# EAGLE design heated-build-platform (EAGLE 5.07)
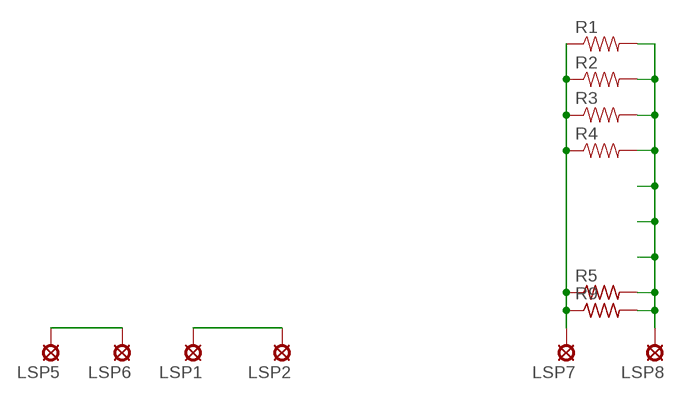
[diagram p0: schematic, sheet 1]

## Parts
LSP1  LSP10  [LSP10]
LSP2  LSP10  [LSP10]
LSP5  LSP10  [LSP10]
LSP6  LSP10  [LSP10]
LSP7  LSP10  [LSP10]
LSP8  LSP10  [LSP10]
R1  RESISTOR  [0805]
R2  RESISTOR  [0805]
R3  RESISTOR1206  [1206]
R4  RESISTOR1206  [1206]
R5  R-US_0204/5  [0204/5]
R9  R-US_0204/5  [0204/5]

## Nets
N$3: LSP1.MP LSP2.MP
N$4: LSP5.MP LSP6.MP
N$5: LSP8.MP R1.2 R2.2 R3.2 R4.2 R5.2 R9.2
N$6: LSP7.MP R1.1 R2.1 R3.1 R4.1 R5.1 R9.1

## Library data of the parts
LSP1 LSP2 LSP5-LSP8 = solpad:LSP10: SOLDER PAD drill 1.0 mm, distributor Buerklin, 12H555
R1-R4 = SparkFun:RESISTOR: Resistor Basic schematic elements and footprints for 0603, 1206, and PTH 1/10th watt (small) resistors.
R5 R9 = resistor:R-US_: RESISTOR, American symbol

## Board
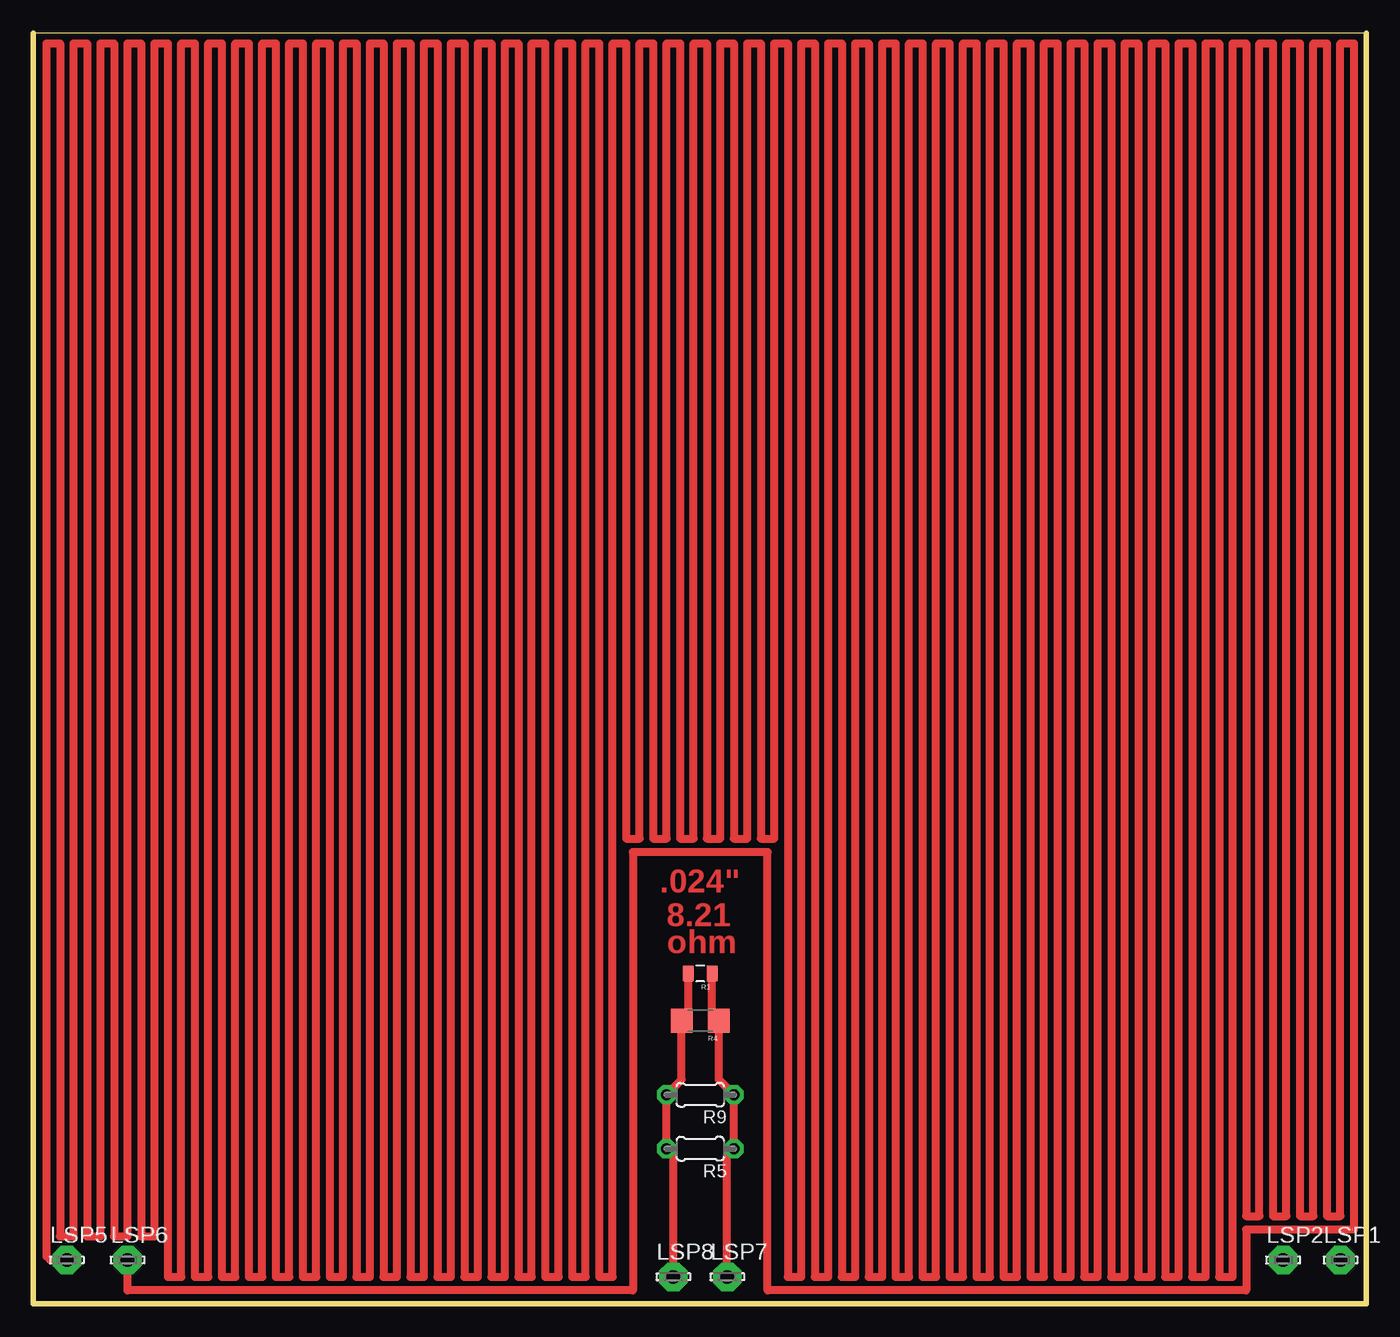
[diagram p1: board, top side]
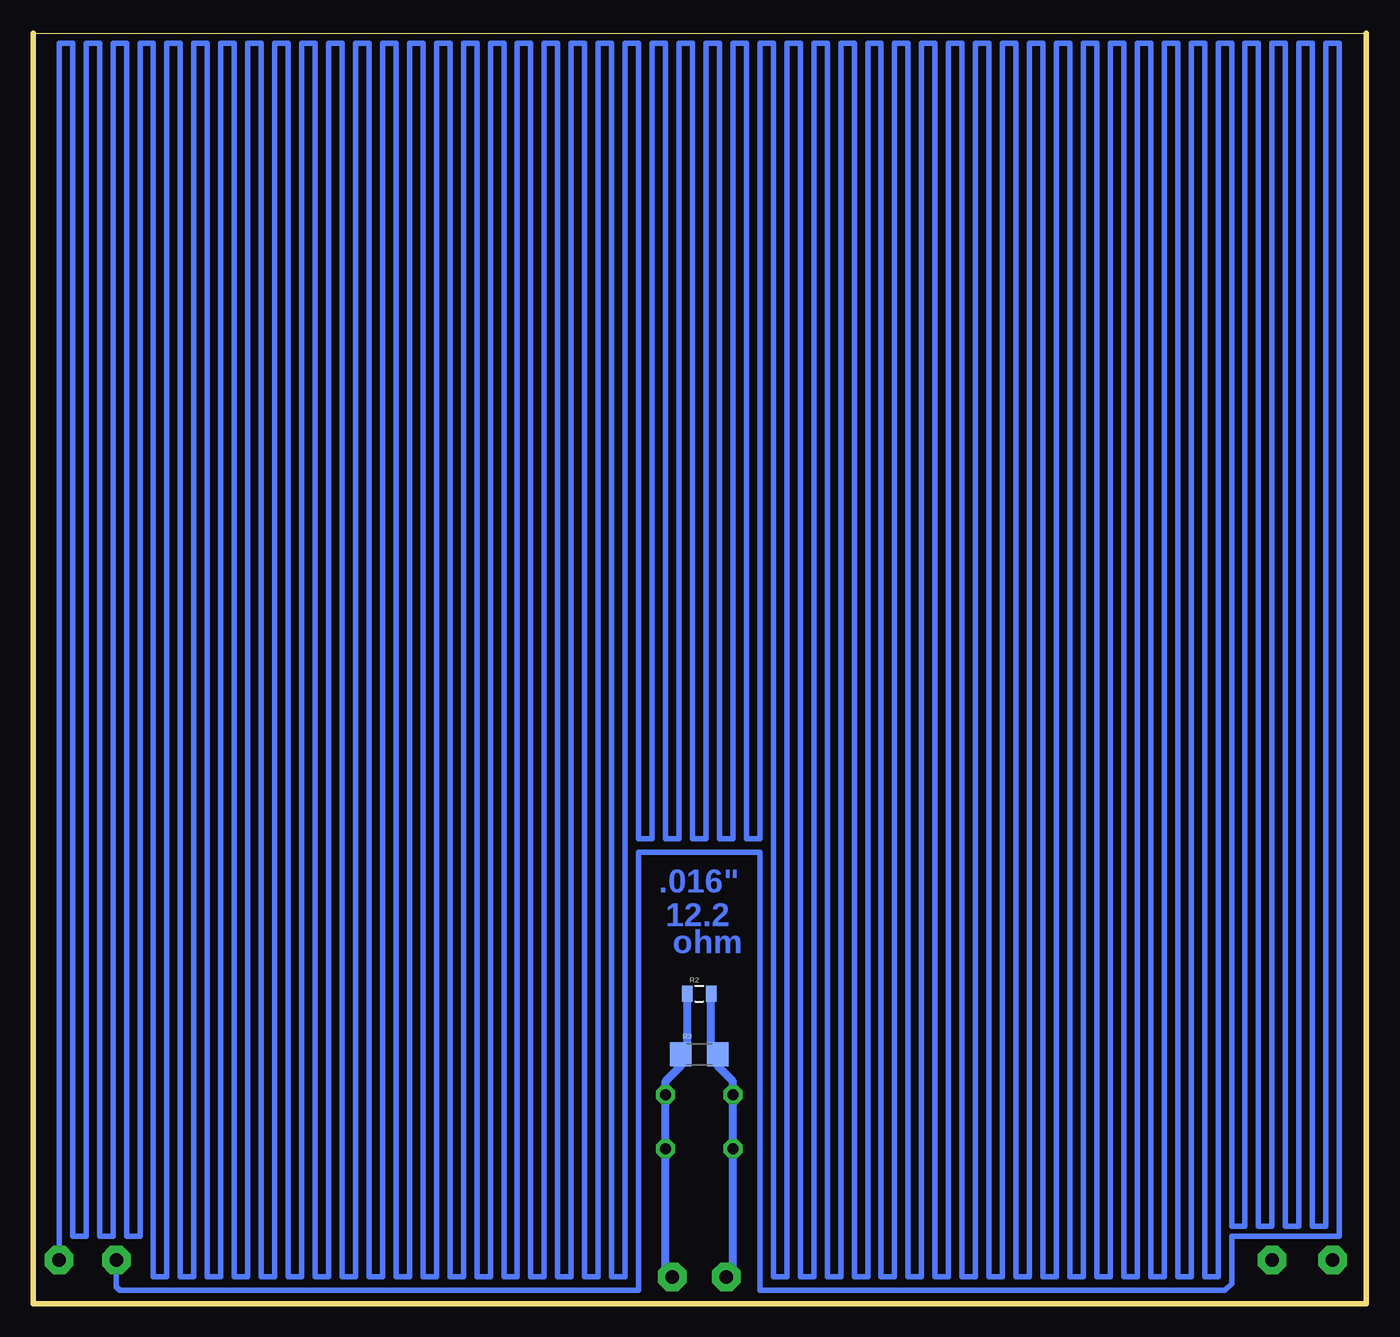
[diagram p2: board, bottom side, seen from below]

Size 100.51 x 95.76 mm. Coordinates in mm from the lower left corner, seen from the top.
Outline: 0,0 100.51,0 100.51,95.75 0,95.76 0,0
Copper layers (1*16): Top 0.035mm / dielectric 1.5mm / Bottom 0.035mm
Design rules "SparkFun": minimum track width 8mil, minimum drill 20mil, track to track 8mil, track to pad 8mil, pad to pad 8mil, via to via 8mil, smd to smd 8mil, copper to edge 10mil, drill to drill 8mil, minimum pad ring 12mil, minimum via ring 10mil, stop-mask expansion 4mil, vias tented up to drill 25mil, thermal gap 10mil

### Footprints (pad centres in the part's own frame; a part is rotated, then mirrored left to right if it is on the bottom)
LSP10 = drill 1.016 pad 2.159 octagon: MP 0,0
0805 = smd 0.8 x 1.2: 1 -0.9,0; 2 0.9,0
1206 = smd 1.6 x 1.8: 1 -1.4,0; 2 1.4,0
0204/5 = drill 0.813 octagon: 1 -2.54,0; 2 2.54,0

### Placement (x,y rotation side)
LSP1  98.55,3.3 0 top
LSP2  94.23,3.3 0 top
LSP5  2.54,3.3 0 top
LSP6  7.11,3.3 0 top
LSP7  52.32,2.03 0 top
LSP8  48.26,2.03 0 top
R1  50.29,24.89 180 top
R2  50.29,23.37 0 bottom
R3  50.29,18.8 0 bottom
R4  50.29,21.34 180 top
R5  50.29,11.68 180 top
R9  50.29,15.75 180 top

### Tracks (layer width: path | path; a pad name or v marks a point on that pad's centre or on a via)
N$3
  Bottom 0.406: LSP1.MP 98.55,95 97.54,95 97.54,5.08 96.52,5.08 96.52,95 95.5,95 95.5,5.08 94.49,5.08 94.49,95 93.47,95 93.47,5.08 92.46,5.08 92.46,95 91.44,95 91.44,2.03 90.42,2.03 90.42,95 89.41,95 89.41,2.03 88.39,2.03 88.39,95 87.38,95 87.38,2.03 86.36,2.03 86.36,95 85.34,95 85.34,2.03 84.33,2.03 84.33,95 83.31,95 83.31,2.03 82.3,2.03 82.3,95 81.28,95 81.28,2.03 80.26,2.03 80.26,95 79.25,95 79.25,2.03 78.23,2.03 78.23,95 77.22,95 77.22,2.03 76.2,2.03 76.2,95 75.18,95 75.18,2.03 74.17,2.03 74.17,95 73.15,95 73.15,2.03 72.14,2.03 72.14,95 71.12,95 71.12,2.03 70.1,2.03 70.1,95 69.09,95 69.09,2.03 68.07,2.03 68.07,95 67.06,95 67.06,2.03 66.04,2.03 66.04,95 65.02,95 65.02,2.03 64.01,2.03 64.01,95 62.99,95 62.99,2.03 61.98,2.03 61.98,95 60.96,95 60.96,2.03 59.94,2.03 59.94,95 58.93,95 58.93,2.03 57.91,2.03 57.91,95 56.9,95 56.9,2.03 55.88,2.03 55.88,95 54.86,95 54.86,35.05 53.85,35.05 53.85,95 52.83,95 52.83,35.05 51.82,35.05 51.82,95 50.8,95 50.8,35.05 49.78,35.05 49.78,95 48.77,95 48.77,35.05 47.75,35.05 47.75,95 46.74,95 46.74,35.05 45.72,35.05 45.72,95 44.7,95 44.7,2.03 43.69,2.03 43.69,95 42.67,95 42.67,2.03 41.66,2.03 41.66,95 40.64,95 40.64,2.03 39.62,2.03 39.62,95 38.61,95 38.61,2.03 37.59,2.03 37.59,95 36.58,95 36.58,2.03 35.56,2.03 35.56,95 34.54,95 34.54,2.03 33.53,2.03 33.53,95 32.51,95 32.51,2.03 31.5,2.03 31.5,95 30.48,95 30.48,2.03 29.46,2.03 29.46,95 28.45,95 28.45,2.03 27.43,2.03 27.43,95 26.42,95 26.42,2.03 25.4,2.03 25.4,95 24.38,95 24.38,2.03 23.37,2.03 23.37,95 22.35,95 22.35,2.03 21.34,2.03 21.34,95 20.32,95 20.32,2.03 19.3,2.03 19.3,95 18.29,95 18.29,2.03 17.27,2.03 17.27,95 16.26,95 16.26,2.03 15.24,2.03 15.24,95 14.22,95 14.22,2.03 13.21,2.03 13.21,95 12.19,95 12.19,2.03 11.18,2.03 11.18,95 10.16,95 10.16,5.84 9.14,5.84 9.14,95 8.13,95 8.13,5.84 7.11,5.84 7.11,95 6.1,95 6.1,5.84 5.08,5.84 5.08,95 4.06,95 4.06,5.84 3.05,5.84 3.05,95 2.03,95 2.03,5.08 10.16,5.08 10.16,1.52 10.67,1.02 45.72,1.02 45.72,34.04 54.86,34.04 54.86,1.02 93.98,1.02 94.23,1.27 LSP2.MP
N$4
  Top 0.61: LSP5.MP 1.27,3.3 1.02,3.56 1.02,95 2.03,95 2.03,5.08 3.05,5.08 3.05,95 4.06,95 4.06,5.08 5.08,5.08 5.08,95 6.1,95 6.1,5.08 7.11,5.08 7.11,95 8.13,95 8.13,5.08 9.14,5.08 9.14,95 10.16,95 10.16,2.03 11.18,2.03 11.18,95 12.19,95 12.19,2.03 13.21,2.03 13.21,95 14.22,95 14.22,2.03 15.24,2.03 15.24,95 16.26,95 16.26,2.03 17.27,2.03 17.27,95 18.29,95 18.29,2.03 19.3,2.03 19.3,95 20.32,95 20.32,2.03 21.34,2.03 21.34,95 22.35,95 22.35,2.03 23.37,2.03 23.37,95 24.38,95 24.38,2.03 25.4,2.03 25.4,95 26.42,95 26.42,2.03 27.43,2.03 27.43,95 28.45,95 28.45,2.03 29.46,2.03 29.46,95 30.48,95 30.48,2.03 31.5,2.03 31.5,95 32.51,95 32.51,2.03 33.53,2.03 33.53,95 34.54,95 34.54,2.03 35.56,2.03 35.56,95 36.58,95 36.58,2.03 37.59,2.03 37.59,95 38.61,95 38.61,2.03 39.62,2.03 39.62,95 40.64,95 40.64,2.03 41.66,2.03 41.66,95 42.67,95 42.67,2.03 43.69,2.03 43.69,95 44.7,95 44.7,35.05 45.72,35.05 45.72,95 46.74,95 46.74,35.05 47.75,35.05 47.75,95 48.77,95 48.77,35.05 49.78,35.05 49.78,95 50.8,95 50.8,35.05 51.82,35.05 51.82,95 52.83,95 52.83,35.05 53.85,35.05 53.85,95 54.86,95 54.86,35.05 55.88,35.05 55.88,95 56.9,95 56.9,2.03 57.91,2.03 57.91,95 58.93,95 58.93,2.03 59.94,2.03 59.94,95 60.96,95 60.96,2.03 61.98,2.03 61.98,95 62.99,95 62.99,2.03 64.01,2.03 64.01,95 65.02,95 65.02,2.03 66.04,2.03 66.04,95 67.06,95 67.06,2.03 68.07,2.03 68.07,95 69.09,95 69.09,2.03 70.1,2.03 70.1,95 71.12,95 71.12,2.03 72.14,2.03 72.14,95 73.15,95 73.15,2.03 74.17,2.03 74.17,95 75.18,95 75.18,2.03 76.2,2.03 76.2,95 77.22,95 77.22,2.03 78.23,2.03 78.23,95 79.25,95 79.25,2.03 80.26,2.03 80.26,95 81.28,95 81.28,2.03 82.3,2.03 82.3,95 83.31,95 83.31,2.03 84.33,2.03 84.33,95 85.34,95 85.34,2.03 86.36,2.03 86.36,95 87.38,95 87.38,2.03 88.39,2.03 88.39,95 89.41,95 89.41,2.03 90.42,2.03 90.42,95 91.44,95 91.44,6.6 92.46,6.6 92.46,95 93.47,95 93.47,6.6 94.49,6.6 94.49,95 95.5,95 95.5,6.6 96.52,6.6 96.52,95 97.54,95 97.54,6.6 98.55,6.6 98.55,95 99.57,95 99.57,5.59 91.44,5.59 91.44,1.02 55.37,1.02 55.37,34.04 45.21,34.04 45.21,1.02 7.11,1.02 LSP6.MP
N$5
  Top 0.61: LSP8.MP 48.26,11.18 R5.2 R9.2 48.89,16.89 R4.2 49.39,21.84 R1.2
  Bottom 0.61: LSP8.MP 47.75,2.54 47.75,16.76 48.89,17.9 R3.2 49.39,19.3 R2.2
N$6
  Top 0.61: LSP7.MP 52.32,11.18 R5.1 R9.1 51.69,16.89 R4.1 51.19,21.84 R1.1
  Bottom 0.61: LSP7.MP 52.83,2.54 52.83,16.76 51.69,17.9 R3.1 51.19,19.3 R2.1

### Text on the board
Top: .024" | 8.21 | ohm
Bottom: .016" | 12.2 | ohm